# EAGLE schematic circuitdraft (EAGLE 9.5.1)
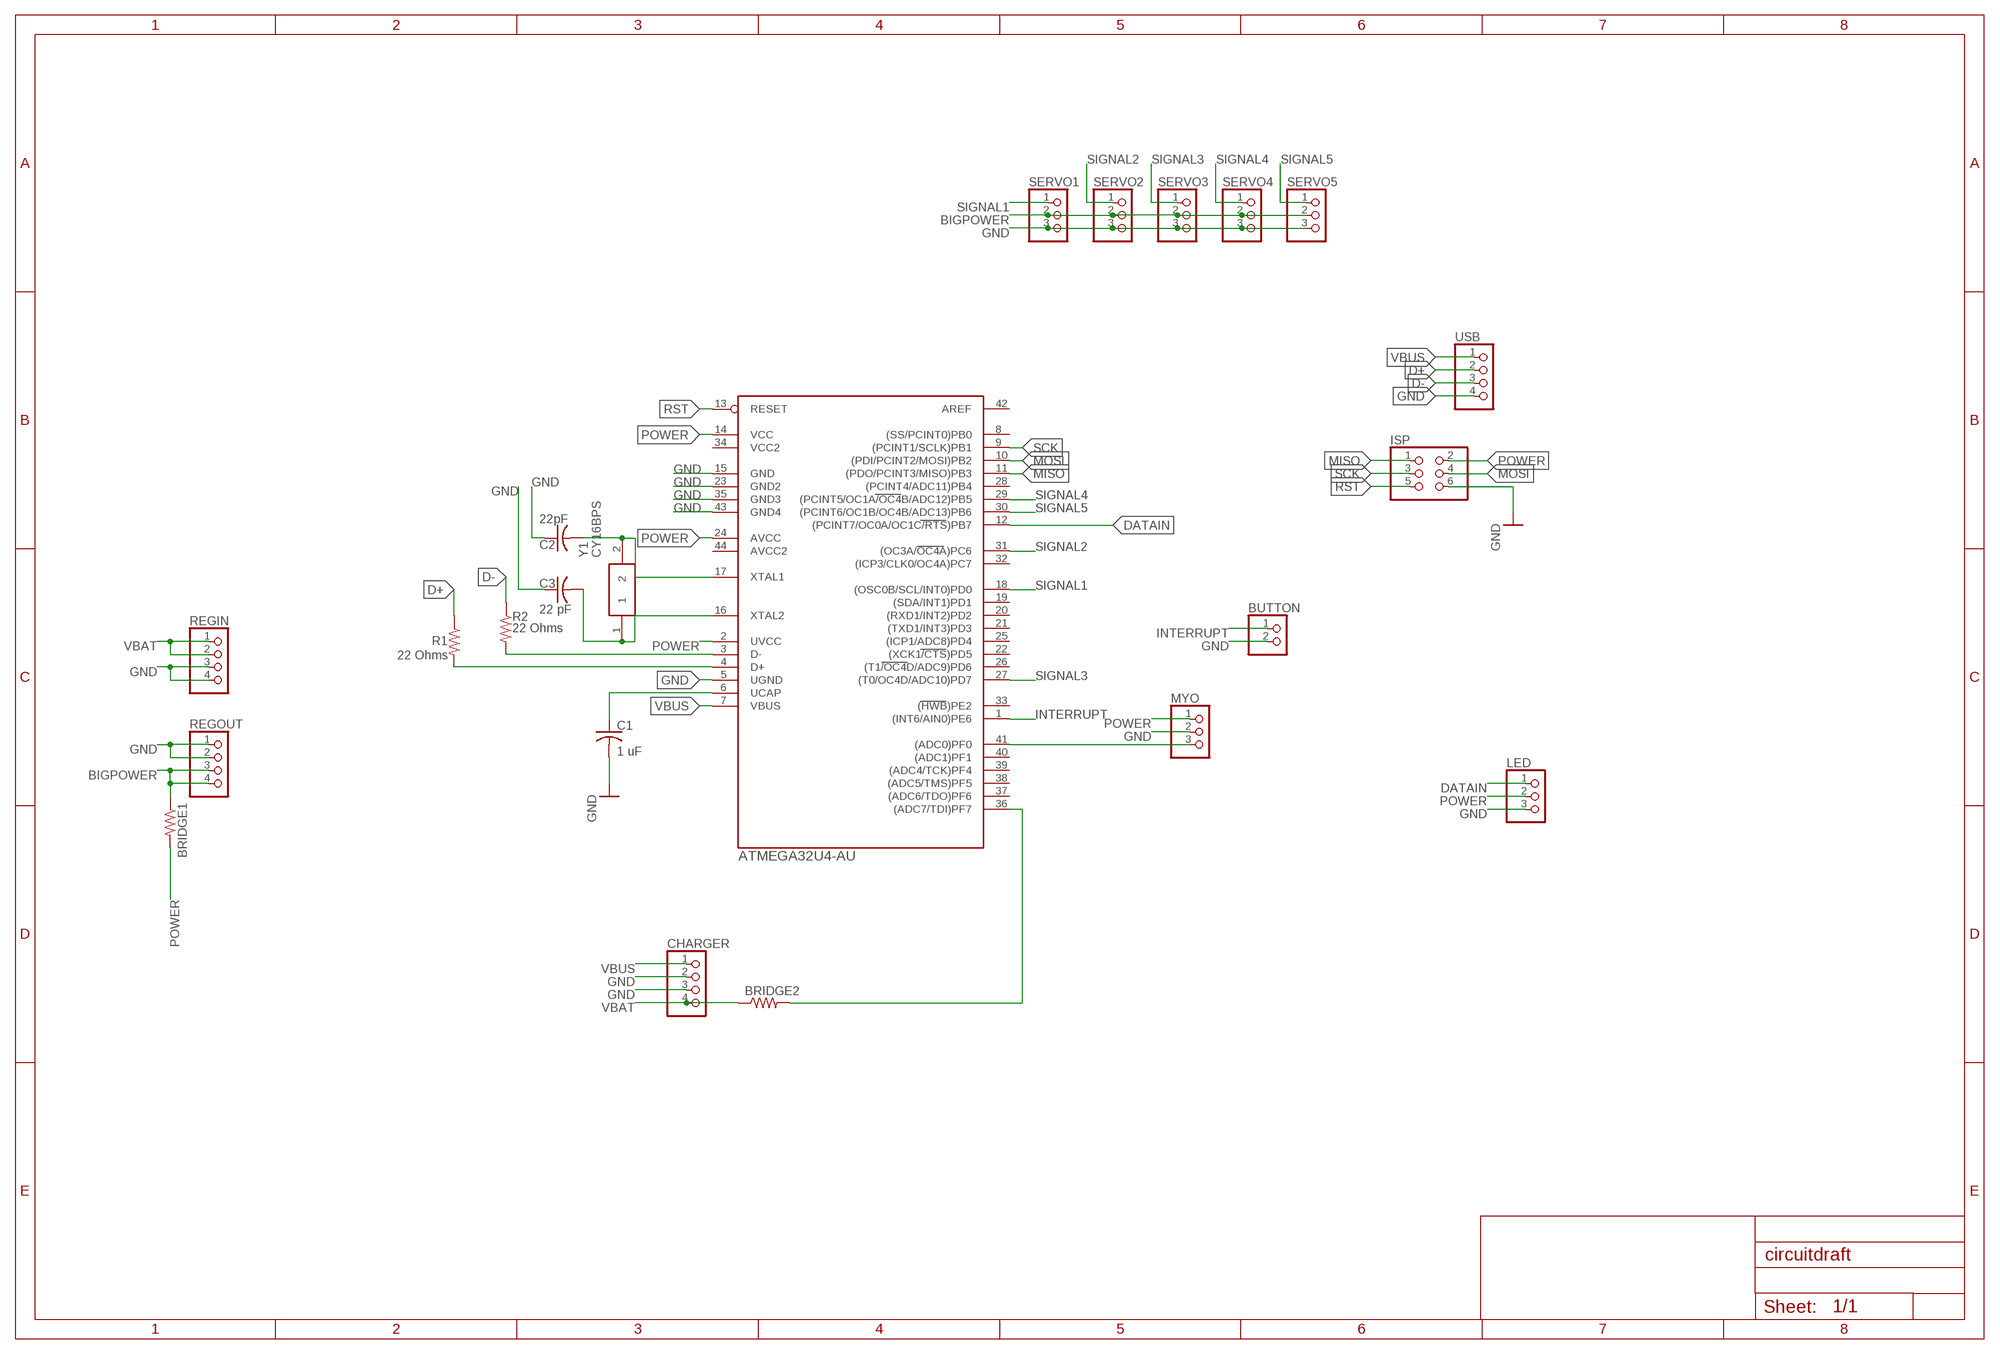
[diagram p0: schematic, sheet 1]

## Parts
BRIDGE1  R-US_M0805  [M0805]
BRIDGE2  R-US_M0805  [M0805]
BUTTON  PINHD-1X2  [1X02]
C1  1 uF  C-US050-024X044  [C050-024X044]
C2  22pF  C-US025-024X044  [C025-024X044]
C3  22 pF  C-US025-024X044  [C025-024X044]
CHARGER  PINHD-1X4  [1X04]
ISP  PINHD-2X3  [2X03]
LED  PINHD-1X3  [1X03]
MYO  PINHD-1X3  [1X03]
R1  22 Ohms  R-US_0207/10  [0207/10]
R2  22 Ohms  R-US_0207/10  [0207/10]
REGIN  PINHD-1X4  [1X04]
REGOUT  PINHD-1X4  [1X04]
SERVO1  PINHD-1X3  [1X03]
SERVO2  PINHD-1X3  [1X03]
SERVO3  PINHD-1X3  [1X03]
SERVO4  PINHD-1X3  [1X03]
SERVO5  PINHD-1X3  [1X03]
U$1  ATMEGA32U4-AU  [TQFP44]
USB  PINHD-1X4  [1X04]
Y1  CY16BPS  [CY16BPS]

## Nets
BIGPOWER [power]: BRIDGE1.1 REGOUT.3 REGOUT.4 SERVO1.2 SERVO2.2 SERVO3.2 SERVO4.2 SERVO5.2
D+: R1.1 USB.2
D-: R2.1 USB.3
DATAIN: LED.1 U$1.12((PCINT7/OC0A/OC1C/RTS)PB7)
GND: BUTTON.2 C1.2 C2.1 C3.1 CHARGER.2 CHARGER.3 ISP.6 LED.3 MYO.2 REGIN.3 REGIN.4 REGOUT.1 REGOUT.2 SERVO1.3 SERVO2.3 SERVO3.3 SERVO4.3 SERVO5.3 U$1.5(UGND) U$1.15(GND) U$1.23(GND2) U$1.35(GND3) U$1.43(GND4) USB.4
INTERRUPT: BUTTON.1 U$1.1((INT6/AIN0)PE6)
MISO: ISP.1 U$1.11((PDO/PCINT3/MISO)PB3)
MOSI: ISP.4 U$1.10((PDI/PCINT2/MOSI)PB2)
N$1: MYO.3 U$1.41((ADC0)PF0)
N$2: R2.2 U$1.3(D-)
N$3: C1.1 U$1.6(UCAP)
N$4: R1.2 U$1.4(D+)
N$5: C2.2 U$1.17(XTAL1) Y1.2
N$6: C3.2 U$1.16(XTAL2) Y1.1
N$9: BRIDGE2.2 U$1.36((ADC7/TDI)PF7)
POWER: BRIDGE1.2 ISP.2 LED.2 MYO.1 U$1.2(UVCC) U$1.14(VCC) U$1.24(AVCC)
RST: ISP.5 U$1.13(RESET)
SCK: ISP.3 U$1.9((PCINT1/SCLK)PB1)
SIGNAL1: SERVO1.1 U$1.18((OSC0B/SCL/INT0)PD0)
SIGNAL2: SERVO2.1 U$1.31((OC3A/OC4A)PC6)
SIGNAL3: SERVO3.1 U$1.27((T0/OC4D/ADC10)PD7)
SIGNAL4: SERVO4.1 U$1.29((PCINT5/OC1A/OC4B/ADC12)PB5)
SIGNAL5: SERVO5.1 U$1.30((PCINT6/OC1B/OC4B/ADC13)PB6)
VBAT [power]: BRIDGE2.1 CHARGER.4 REGIN.1 REGIN.2
VBUS: CHARGER.1 U$1.7(VBUS) USB.1
Unconnected: U$1.8((SS/PCINT0)PB0) U$1.19((SDA/INT1)PD1) U$1.20((RXD1/INT2)PD2) U$1.21((TXD1/INT3)PD3) U$1.22((XCK1/CTS)PD5) U$1.25((ICP1/ADC8)PD4) U$1.26((T1/OC4D/ADC9)PD6) U$1.28((PCINT4/ADC11)PB4) U$1.32((ICP3/CLK0/OC4A)PC7) U$1.33((HWB)PE2) U$1.34(VCC2) U$1.37((ADC6/TDO)PF6) U$1.38((ADC5/TMS)PF5) U$1.39((ADC4/TCK)PF4) U$1.40((ADC1)PF1) U$1.42(AREF) U$1.44(AVCC2)

## Library data of the parts
BRIDGE1 BRIDGE2 R1 R2 = rcl:R-US_: RESISTOR, American symbol; SPICEPREFIX: R
BUTTON = pinhead:PINHD-1X2: PIN HEADER
C1-C3 = rcl:C-US: CAPACITOR, American symbol; SPICEPREFIX: C
CHARGER REGIN REGOUT USB = pinhead:PINHD-1X4: PIN HEADER
ISP = pinhead:PINHD-2X3: PIN HEADER
LED MYO SERVO1-SERVO5 = pinhead:PINHD-1X3: PIN HEADER
U$1 = mega32U4:ATMEGA32U4-AU
Y1 = SamacSys_Parts:CY16BPS: Crystals 16MHz 20pF 0C +70C Source: Datasheet <https://componentsearchengine.com/Datasheets/1/CY16BPS.pdf>; DESCRIPTION: Crystals 16MHz 20pF 0C +70C; HEIGHT: 5mm; MANUFACTURER_NAME: Crystek; MANUFACTURER_PART_NUMBER: CY16BPS; MOUSER_PART_NUMBER: 549-CY16BPS; MOUSER_PRICE-STOCK: https://www.mouser.com/Search/Refine.aspx?Keyword=549-CY16BPS

## Net classes
1 power: width 1 mm